# Altium project ENCE461SAM4s.PrjPcb
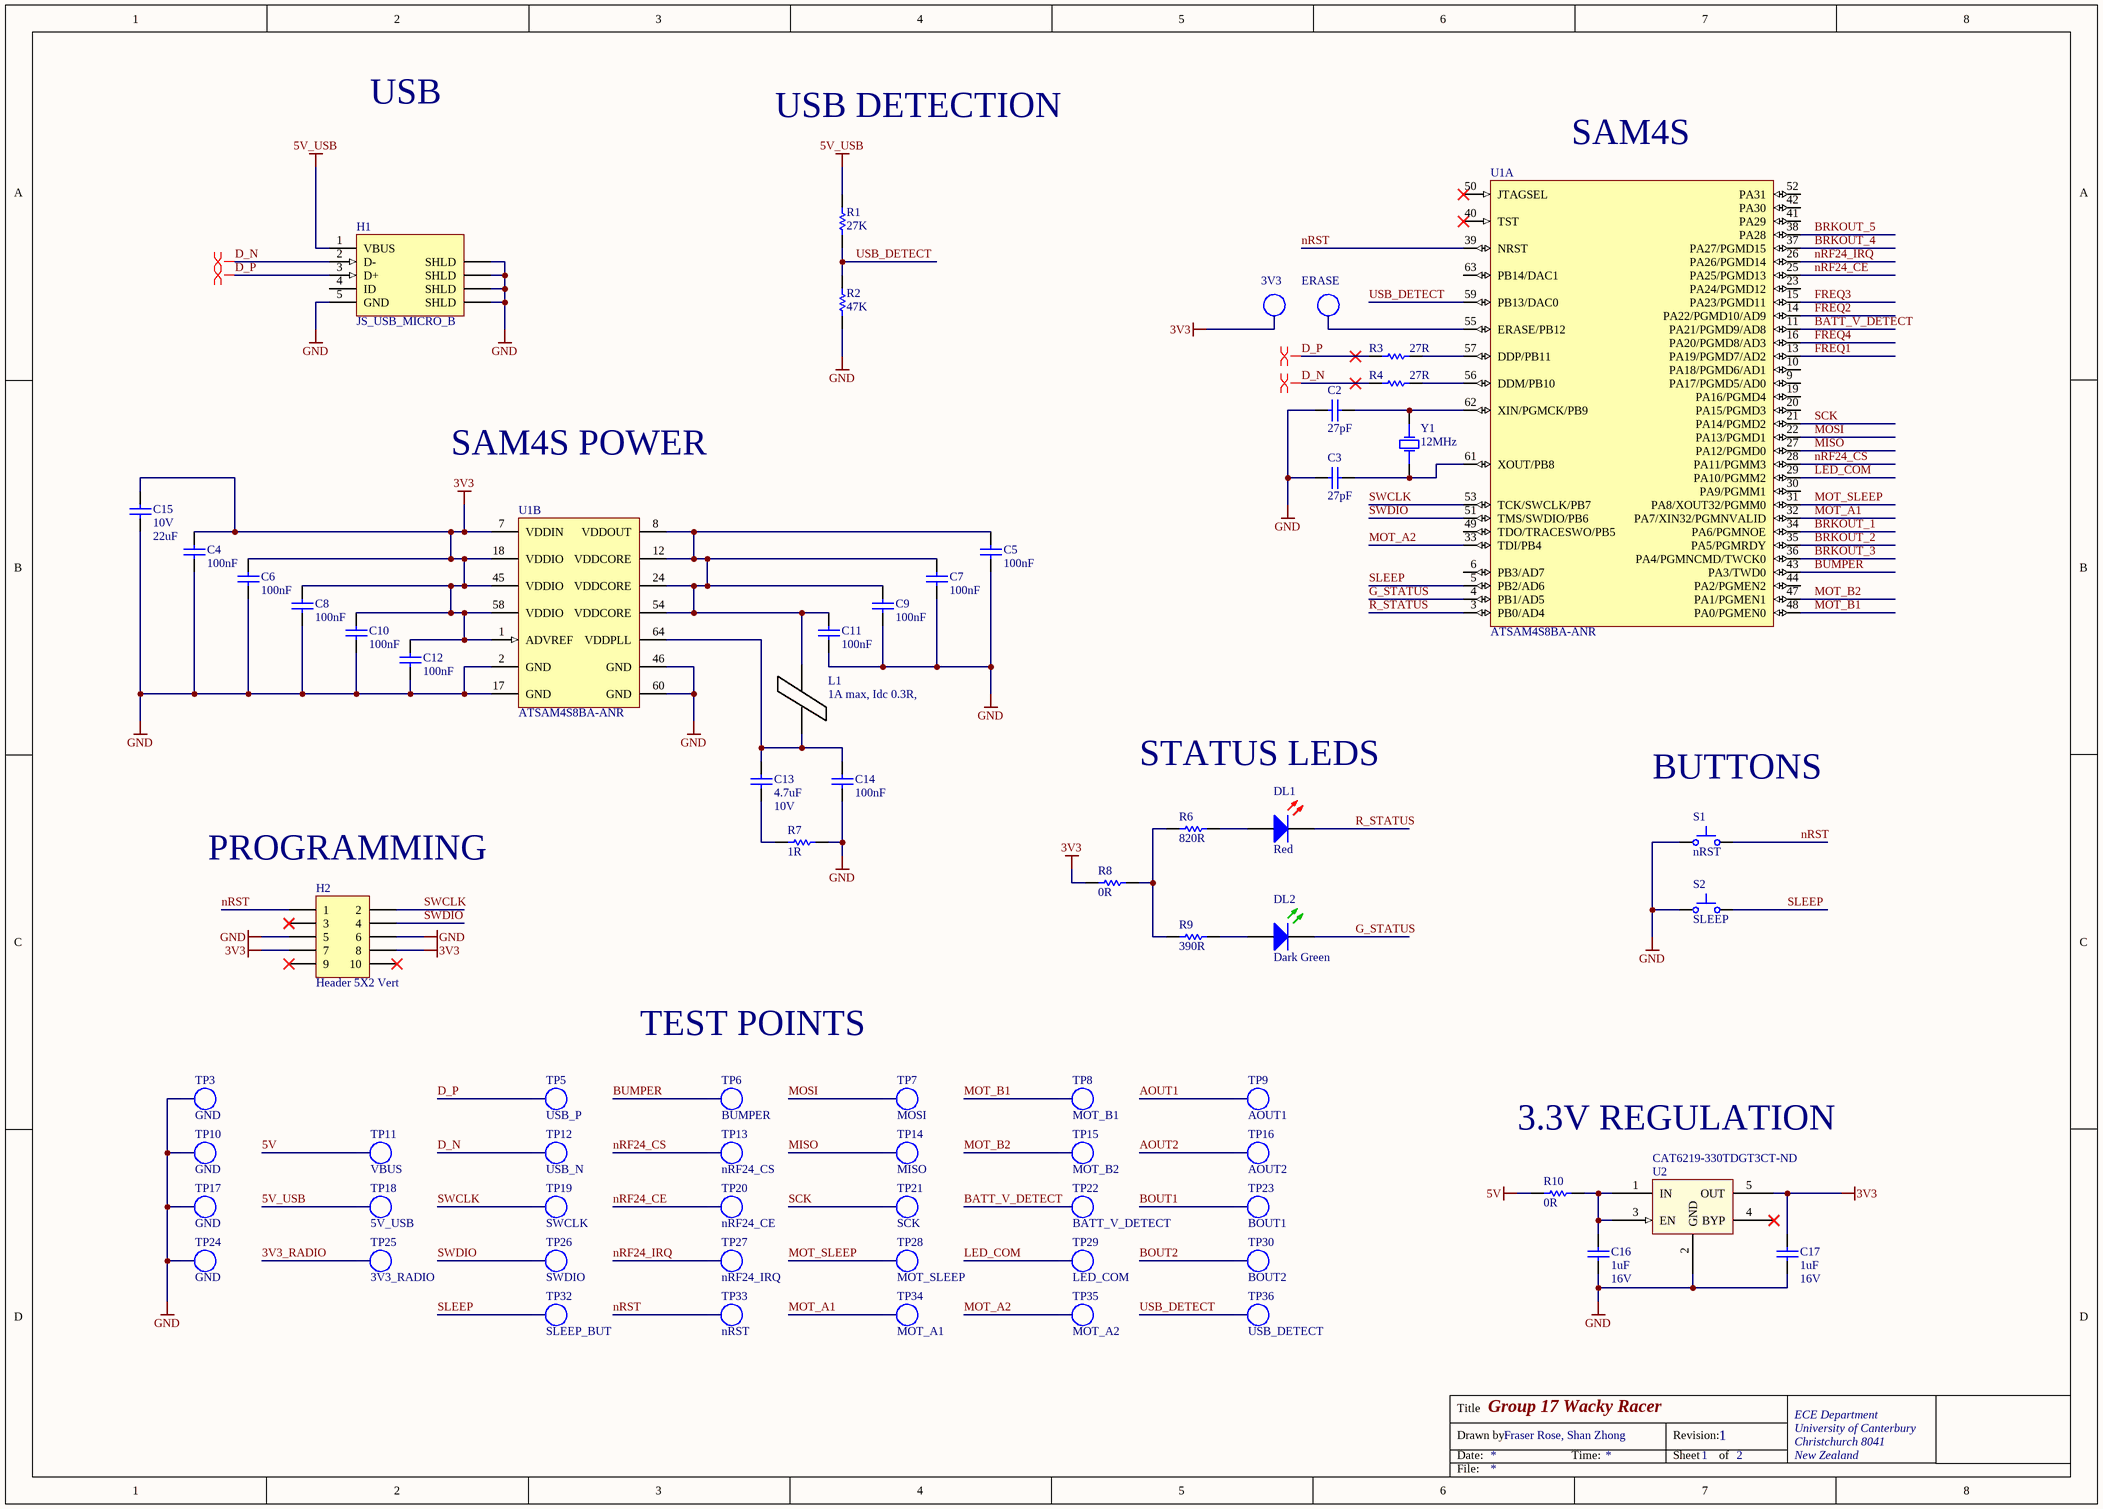
[diagram p0: SAM4s_Schematic.SchDoc]
2 sheets, 111 parts. Net scope: global (net labels, ports and power ports of the same name join across sheets).
Board file: RacerPCB.PcbDoc
Sheets:
  SAM4s_Schematic.SchDoc
  Ancillaries.SchDoc

## Sheet SAM4s_Schematic.SchDoc: Group 17 Wacky Racer
size A3; DrawnBy: Fraser Rose, Shan Zhong; Address1: ECE Department; Address2: University of Canterbury; Address3: Christchurch 8041; Address4: New Zealand; Revision: 1; SheetNumber: 1; SheetTotal: 2

### Parts
C2  27pF  [CAPC1608N]
C3  27pF  [CAPC1608N]
C4  100nF  [CAPC1608N]
C5  100nF  [CAPC1608N]
C6  100nF  [CAPC1608N]
C7  100nF  [CAPC1608N]
C8  100nF  [CAPC1608N]
C9  100nF  [CAPC1608N]
C10  100nF  [CAPC1608N]
C11  100nF  [CAPC1608N]
C12  100nF  [CAPC1608N]
C13  Max Voltage: 10V  [CAPC1608N]  (hidden comment: 4.7uF)
C14  100nF  [CAPC1608N]
C15  Max Voltage: 10V  [CAPC3216N]  (hidden comment: 22uF)
C16  Max Voltage: 16V  [CAPC1608N]  (hidden comment: 1uF)
C17  Max Voltage: 16V  [CAPC1608N]  (hidden comment: 1uF)
DL1  Red  [WL-SMCW0603]
DL2  Dark Green  [WL-SMCW0603]
H1  JS_USB_MICRO_B  [FCI_USB_10118194-0001LF]
H2  Header 5X2 Vert  [IDC2.54-V10D]
L1  1A max, Idc 0.3R,  [INDC3216N]
R1  27K  [RESC1608N]
R2  47K  [RESC1608N]
R3  27R  [RESC1608N]
R4  27R  [RESC1608N]
R6  820R  [RESC1608N]
R7  1R  [RESC3216N]
R8  0R  [RESC1608N]
R9  390R  [RESC1608N]
R10  0R  [RESC1608N]
S1  nRST  [EVQPNF05M]
S2  SLEEP  [EVQPNF05M]
TP1  3V3  [TP_0603]
TP2  ERASE  [TP_0603]
TP3  GND  [TP_0603]
TP5  USB_P  [TP_0603]
TP6  BUMPER  [TP_0603]
TP7  MOSI  [TP_0603]
TP8  MOT_B1  [TP_0603]
TP9  AOUT1  [TP_0603]
TP10  GND  [TP_0603]
TP11  VBUS  [TP_0603]
TP12  USB_N  [TP_0603]
TP13  nRF24_CS  [TP_0603]
TP14  MISO  [TP_0603]
TP15  MOT_B2  [TP_0603]
TP16  AOUT2  [TP_0603]
TP17  GND  [TP_0603]
TP18  5V_USB  [TP_0603]
TP19  SWCLK  [TP_0603]
TP20  nRF24_CE  [TP_0603]
TP21  SCK  [TP_0603]
TP22  BATT_V_DETECT  [TP_0603]
TP23  BOUT1  [TP_0603]
TP24  GND  [TP_0603]
TP25  3V3_RADIO  [TP_0603]
TP26  SWDIO  [TP_0603]
TP27  nRF24_IRQ  [TP_0603]
TP28  MOT_SLEEP  [TP_0603]
TP29  LED_COM  [TP_0603]
TP30  BOUT2  [TP_0603]
TP32  SLEEP_BUT  [TP_0603]
TP33  nRST  [TP_0603]
TP34  MOT_A1  [TP_0603]
TP35  MOT_A2  [TP_0603]
TP36  USB_DETECT  [TP_0603]
U1  ATSAM4S8BA-ANR  [LQFP64_L]  (parts A,B of 2)
U2  Supplier Part Number: CAT6219-330TDGT3CT-ND  [SOT95P280X145-5N]  (hidden comment: CAT6219-330TDGT3)
Y1  12MHz  [6.0X3.5-4]

### Nets
3V3: C4.2 C6.2 C8.2 C10.2 C12.2 C15.2 C17.2 H2.7 H2.8 R8.2 TP1.1(TP) U1.1(ADVREF) U1.7(VDDIN) U1.18(VDDIO) U1.45(VDDIO) U1.58(VDDIO) U2.5(OUT)
3V3_RADIO: TP25.1(TP)
5V: R10.2 TP11.1(TP)
5V_USB: H1.1(VBUS) R1.2 TP18.1(TP)
GND: C2.1 C3.1 C4.1 C5.1 C6.1 C7.1 C8.1 C9.1 C10.1 C11.1 C12.1 C14.1 C15.1 C16.1 C17.1 H1.5(GND) H1.6(SHLD) H2.5 H2.6 R2.1 R7.1 S1.1 S2.1 TP3.1(TP) TP10.1(TP) TP17.1(TP) TP24.1(TP) U1.2(GND) U1.17(GND) U1.46(GND) U1.60(GND) U2.2(GND)
AOUT1: TP9.1(TP)
AOUT2: TP16.1(TP)
BATT_V_DETECT: TP22.1(TP) U1.11(PA21/PGMD9/AD8)
BOUT1: TP23.1(TP)
BOUT2: TP30.1(TP)
BRKOUT_1: U1.34(PA6/PGMNOE)
BRKOUT_2: U1.35(PA5/PGMRDY)
BRKOUT_3: U1.36(PA4/PGMNCMD/TWCK0)
BRKOUT_4: U1.37(PA27/PGMD15)
BRKOUT_5: U1.38(PA28)
BUMPER: TP6.1(TP) U1.43(PA3/TWD0)
D_N: H1.2(D-) R4.1 TP12.1(TP)
D_P: H1.3(D+) R3.1 TP5.1(TP)
FREQ1: U1.13(PA19/PGMD7/AD2)
FREQ2: U1.14(PA22/PGMD10/AD9)
FREQ3: U1.15(PA23/PGMD11)
FREQ4: U1.16(PA20/PGMD8/AD3)
G_STATUS: DL2.1(K) U1.4(PB1/AD5)
LED_COM: TP29.1(TP) U1.29(PA10/PGMM2)
MISO: TP14.1(TP) U1.27(PA12/PGMD0)
MOSI: TP7.1(TP) U1.22(PA13/PGMD1)
MOT_A1: TP34.1(TP) U1.32(PA7/XIN32/PGMNVALID)
MOT_A2: TP35.1(TP) U1.33(TDI/PB4)
MOT_B1: TP8.1(TP) U1.48(PA0/PGMEN0)
MOT_B2: TP15.1(TP) U1.47(PA1/PGMEN1)
MOT_SLEEP: TP28.1(TP) U1.31(PA8/XOUT32/PGMM0)
nRF24_CE: TP20.1(TP) U1.25(PA25/PGMD13)
nRF24_CS: TP13.1(TP) U1.28(PA11/PGMM3)
nRF24_IRQ: TP27.1(TP) U1.26(PA26/PGMD14)
nRST: H2.1 S1.2 TP33.1(TP) U1.39(NRST)
R_STATUS: DL1.1(K) U1.3(PB0/AD4)
SCK: TP21.1(TP) U1.21(PA14/PGMD2)
SLEEP: S2.2 TP32.1(TP) U1.5(PB2/AD6)
SWCLK: H2.2 TP19.1(TP) U1.53(TCK/SWCLK/PB7)
SWDIO: H2.4 TP26.1(TP) U1.51(TMS/SWDIO/PB6)
USB_DETECT: R1.1 R2.2 TP36.1(TP) U1.59(PB13/DAC0)
NetC2_2: C2.2 U1.62(XIN/PGMCK/PB9) Y1.3(OSC2)
NetC3_2: C3.2 U1.61(XOUT/PB8) Y1.1(OSC1)
NetC5_2: C5.2 C7.2 C9.2 C11.2 L1.2 U1.8(VDDOUT) U1.12(VDDCORE) U1.24(VDDCORE) U1.54(VDDCORE)
NetC13_1: C13.1 R7.2
NetC13_2: C13.2 C14.2 L1.1 U1.64(VDDPLL)
NetC16_2: C16.2 R10.1 U2.1(IN) U2.3(EN)
NetDL1_2: DL1.2(A) R6.1
NetDL2_2: DL2.2(A) R9.2
NetR3_2: R3.2 U1.57(DDP/PB11)
NetR4_2: R4.2 U1.56(DDM/PB10)
NetR6_2: R6.2 R8.1 R9.1
NetTP2_1: TP2.1(TP) U1.55(ERASE/PB12)

Not connected (* = marked no-connect by the designer): H1 4(ID); H2 3* 9* 10*; U1 6(PB3/AD7) 9(PA17/PGMD5/AD0) 10(PA18/PGMD6/AD1) 19(PA16/PGMD4) 20(PA15/PGMD3) 23(PA24/PGMD12) 30(PA9/PGMM1) 40(TST)* 41(PA29) 42(PA30) 44(PA2/PGMEN2) 49(TDO/TRACESWO/PB5) 50(JTAGSEL)* 52(PA31) 63(PB14/DAC1); U2 4(BYP)*

### Layout directives
differential pair: D_N, D_P

### Notes on the sheet
- USB
- USB DETECTION
- (near U1) SAM4S
- SAM4S POWER
- STATUS LEDS
- BUTTONS
- (near H2) PROGRAMMING
- TEST POINTS
- 3.3V REGULATION
- Title
- Drawn by:
- Date:
- Time:
- Revision:
- Sheet
- of
- File:

### Library data of the parts
C2 C3 = CC_27pF_0603: CAP CER 27pF NPO/COG +-5% 50V 0603; PackageReference: 0603; Code_IPC: 1608 [0603]; Verify: *; Supplier: ECE Dept; Storage Location: PCB Assembly WS; Value: 27pF
C4-C12 C14 = CC_100nF_0603: CAP CER 100nF X7R +-10% 50V 0603; PackageReference: 0603; Code_IPC: 1608 [0603]; Verify: *; Supplier: ECE Dept; Storage Location: PCB Assembly WS; Value: 100nF
C13 = CC_4.7uF_0603: CAP CER 4.7uF X5R +-20%  10V 0603; Note: Footprint corresponds to dimensions for bulk cassette packaging. This case size has tightened tolerances.; PackageReference: 0805; Code_IPC: 2012[0805]; Verify: *; Supplier: ECE Dept; Storage Location: PCB Assembly WS; Value: 4.7uF
C15 = CC_22uF_1206: CAP CER 22uF Y5V -20% +80% 10V 1206; Verify: *; Supplier: ECE Dept; Storage Location: PCB Assembly WS; Dielectric: Y5V; Footprint: 1206 (3216 metric); Value: 22uF
C16 C17 = CC_1uF_0603: CAP CER 1uF Y5V -20% +80% 16V 0603; PackageReference: 0603; Code_IPC: 1608 [0603]; Verify: *; Supplier: ECE Dept; Storage Location: PCB Assembly WS; Value: 1uF
DL1 = DL_150060RS75000: LED Red 250mcd 0603 SMD; Manufacturer: WURTH ELEKTRONIK; Forward Current If: 30; Forward Voltage: 2; Lens Shape: Rectangular; Luminous Intensity: 250; Wavelength Typ: 625; Viewing Angle: 140°; LED Mounting: SMD; Supplier 1: Farnell; Supplier Part Number 1: 2322071; Manufacturer Part Number: 150060RS75000; Storage Location: PCB Assembly WS; Supplier: ECE Dept; LED Colour: Red
DL2 = DL_150060GS75000: LED Dk Green 430mcd 0603 SMD; Manufacturer: WURTH ELEKTRONIK; Forward Current If: 30; Wavelength Typ: 520; Forward Voltage: 3.2; Lens Shape: Rectangular; Luminous Intensity: 430; Viewing Angle: 140°; LED Mounting: SMD; Supplier 1: Farnell; Supplier Part Number 1: 2322070; Manufacturer Part Number: 150060GS75000; Storage Location: PCB Assembly WS; Supplier: ECE Dept; LED Colour: Dark Green
H1 = JS_USB_MICRO_B_SMT: CONN USB MICRO B RECPT SMT R/A; Manufacturer: FCI; Manufacturer Part Number: 10118194-0001LF; Gender: Receptacle; Number of Contacts: 5; Specifications: USB 2.0; Supplier 1: Digi-Key; Supplier Part Number 1: 609-4618-1-ND; Features: Shielded, Solder Retention; Mounting Type: Surface Mount, Right Angle, Horizontal
H2 = JA_HDR_IDC_5X2_VERT: IDC Header, 2,54mm, 10-Pin, Vert; Supplier: ECE Dept; Supplier 1: Farnell; Supplier Part Number 1: 1096985; Storage Location: ECE Dept Store
L1 = IN_Ferrite-Bead: Ferrite Bead, Rdc 0.3R, Z100MHZ 600R, Imax 1A, SMD 1206; Manufacturer: FAIR-RITE; Manufacturer PN: 2512066017Y1; DC Current Rating: 1; DC Resistance Max: 0.08; Ferrite Case Style: 1206 ^3216 Metric]; Frequency Range: 50MHz to 1; Impedance: 600; Impedance Tolerance: ± 25%; Supplier: ECE Dept; Storage Location: PCB Assembly WS; Ferrite Mounting: SMD; Supplier 1: Farnell; Supplier Part Number 1: 1612060; Manufacturer Part Number: 2512066017Y1; Value: 1A max, Idc 0.3R,
R1 = RS_27K: RES 27K OHM 1/10W 5% 0603 SMD; Storage Location: PCB Assembly WS; Supplier: ECE Dept; Value: 27K
R2 = RS_47K: RES 47.0K OHM 1/10W 5% 0603 SMD; Storage Location: PCB Assembly WS; Supplier: ECE Dept; Value: 47K
R3 R4 = RS_27R: RES 27 OHM 1/10W 5% 0603 SMD; Storage Location: PCB Assembly WS; Supplier: ECE Dept; Value: 27R
R6 = RS_820R: RES 820 OHM 1/10W 5% 0603 SMD; Storage Location: PCB Assembly WS; Supplier: ECE Dept; Value: 820R
R7 = RT_1R: RES 1R OHM 1/4W 5% 1206 SMD; Storage Location: PCB Assembly WS; Supplier: ECE Dept; Value: 1R
R8 R10 = RS_0R0: RES 0.0 OHM 1/10W 5% 0603 SMD; Storage Location: PCB Assembly WS; Supplier: ECE Dept; Value: 0R
R9 = RS_390R: RES 390 OHM 1/10W 5% 0603 SMD; Storage Location: PCB Assembly WS; Supplier: ECE Dept; Value: 390R
S1 S2 = WS_EVQPNF05M: Panasonic 6 x 3.5mm SMD Light Touch Switch Type SMD; PackageDescription: 6.0 x 3.5 mm; Supplier 1: Farnell; Supplier Part Number 1: 2079481; Manufacturer: Panasonic; Manufacturer PN: EVQPNF05M; Supplier 2: Digi-Key; Supplier Part Number 2: P13598SCT-ND; Storage Location: PCB Assembly WS; Supplier: ECE Dept
TP1-TP3 TP5-TP30 TP32-TP36 = TP_0603: Test Point 1.65X0.9X1.2mm SMD; Manufacturer: TE Connectivity AMP Connectors; Manufacturer Part Number: 1625854-3; Supplier 1: Digi-Key; Mounting Type: Surface Mount; Terminal: 0.063" x 0.031" x 0.045" (1.60mm x 0.80mm x 1.15mm); Type: PC Test Point; Supplier Part Number 1: A106145CT-ND
U1 = SE_ATSAM4S16BA-MU: IC MCU 32BIT 512KB FLASH 64LQFP; Manufacturer: Atmel; Connectivity: I²C, IrDA, Memory Card, SPI, SSC, UART/USART, USB; Core Processor: ARM® Cortex®-M4; Core Size: 32-Bit; Data Converters: A/D 11x12b, D/A 2x12b; Number of I/O: 47; Peripherals: Brown-out Detect/Reset, DMA, POR, PWM, WDT; Program Memory Size: 512KB (512K x 8); RAM Size: 128K x 8; Speed: 120MHz; Voltage - Supply (Vcc/Vdd): 1.62 V ~ 3.6 V; PackageVersion: revJ, Jul-2007; PackageReference: 64PS; PackageDescription: 64-Pin Quad Flat No-Lead (QFN) Sawn, 9 x 9 x 1.0 mm Body, 0.5 mm Pitch, Exposed Pad; Code_JEDEC: MO-220VMMD-3; ComponentLink1Description: Manufacturer URL; ComponentLink1URL: http://www.atmel.com/; ComponentLink2Description: SAM4S Series Datasheet; ComponentLink2URL: http://www.atmel.com/dyn/resources/prod_documents/11100.pdf; ComponentLink3Description: SAM4S Series Summary; ComponentLink3URL: http://www.atmel.com/dyn/resources/prod_documents/11100S.pdf; Supplier 1: Digi-Key; Package / Case: 64-LQFP; Packaging: Cut Tape (CT); Program Memory Type: FLASH; Supplier Part Number 1: ATSAM4S8BA-ANRCT-ND; Manufacturer Part Number: ATSAM4S8BA-ANR
U2 = SV_CAT6219-330TDGT3: IC REG LIN 3.3V 500MA TSOT23-5; Voltage - Input (Max): 5.5V; Voltage Dropout (Max): 0.5V @ 500mA; Manufacturer Part Number: CAT6219-330TDGT3; Base Part Number: CAT6219; Current - Output: 500mA; Package / Case: SOT-23-5 Thin, TSOT-23-5; Supplier: Digi-Key; Supplier Device Package: TSOT-23-5; Voltage - Output (Min/Fixed): 3.3V; ComponentLink1URL: http://www.onsemi.com/pub/Collateral/CAT6219-D.PDF; ComponentLink1Description: http://www.onsemi.com/pub/Collateral/CAT6219-D.PDF; Supplier 1: Digi-Key
Y1 = XT_CRYSTAL_12MHz_18pF: CRYSTAL 12MHZ 18PF 6X3.5mm SMD; Manufacturer: CTS-Frequency Controls; Manufacturer Part Number: 406C35D12M00000; ESR (Equivalent Series Resistance): 60 Ohm; Frequency Stability: ±50ppm; Frequency Tolerance: ±30ppm; Operating Mode: Fundamental; Supplier 1: Digi-Key; Height: 0.047" (1.20mm); Load Capacitance: 18pF; Mounting Type: Surface Mount; Operating Temperature: -20°C ~ 70°C; Package / Case: 4-SMD, No Lead (DFN, LCC); Size / Dimension: 0.236" L x 0.138" W (6.00mm x 3.50mm); Supplier Part Number 1: CTX855CT-ND; Frequency: 12MHz

## Sheet Ancillaries.SchDoc: Group 17 Wacky Racer
size A3; DrawnBy: Fraser Rose, Shan Zhong; Address1: ECE Department; Address2: University of Canterbury; Address3: Christchurch 8041; Address4: New Zealand; Revision: 1; SheetNumber: 2; SheetTotal: 2
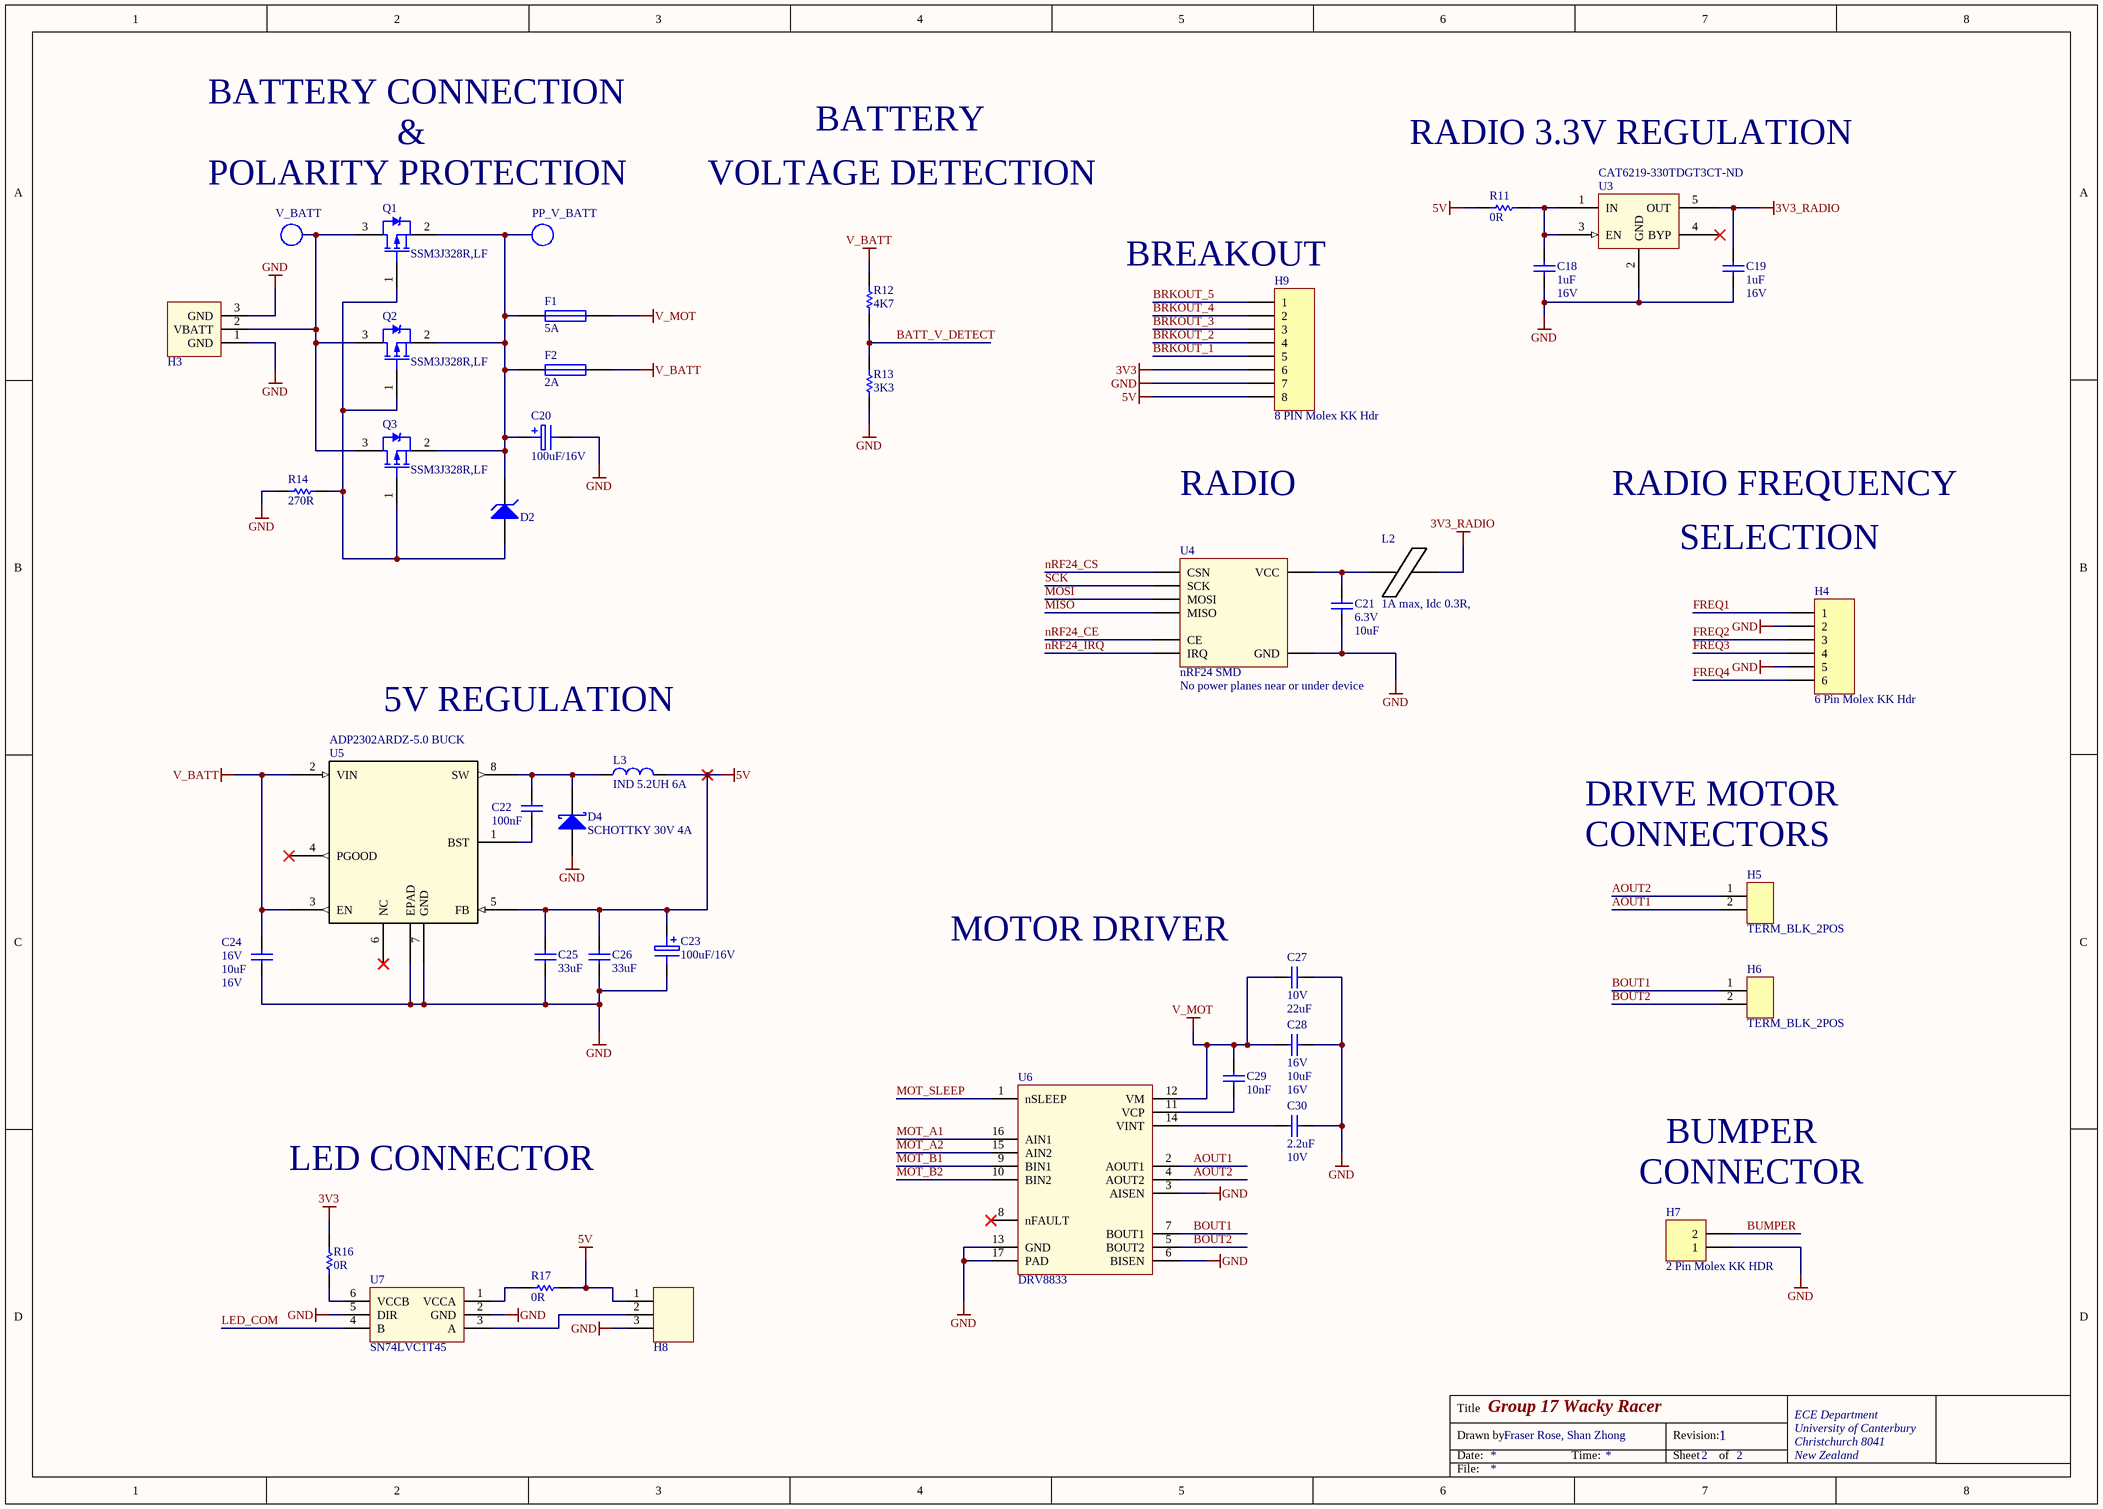
[diagram p1: Ancillaries.SchDoc]

### Parts
1  V_BATT  [TP_0603]
2  PP_V_BATT  [TP_0603]
C18  Max Voltage: 16V  [CAPC1608N]  (hidden comment: 1uF)
C19  Max Voltage: 16V  [CAPC1608N]  (hidden comment: 1uF)
C20  100uF/16V  [NICH-1]
C21  Voltage - Rated: 6.3V  [CAPC1608N]  (hidden comment: 10uF)
C22  100nF  [CAPC1608N]
C23  100uF/16V  [NICH-1]
C24  Voltage - Rated: 16V  [CAPC2012N]  (hidden comment: 10uF)
C25  33uF  [CAPC2012N]
C26  33uF  [CAPC2012N]
C27  Max Voltage: 10V  [CAPC3216N]  (hidden comment: 22uF)
C28  Voltage - Rated: 16V  [CAPC2012N]  (hidden comment: 10uF)
C29  10nF  [CAPC1608N]
C30  Max Voltage: 10V  [CAPC1608N]  (hidden comment: 2.2uF)
D2  DIODE ZENER 5.6V  [DO-214AA_SCL]  (value not drawn)
D4  SCHOTTKY 30V 4A  [SMC]
F1  5A  [RESC3216N]
F2  2A  [RESC3216N]
H3  Battery_HEADER_3pin  [BATT_HEADER_3POS]  (value not drawn)
H4  6 Pin Molex KK Hdr  [MOLEX_KK_6_HDR]
H5  TERM_BLK_2POS  [TERM_BLK_2POS]
H6  TERM_BLK_2POS  [TERM_BLK_2POS]
H7  2 Pin Molex KK HDR  [MOLEX_KK_2_HDR]
H8  HEADER_3  [HEADER_3POS]  (value not drawn)
H9  8 PIN Molex KK Hdr  [MOLEX_KK_8_HDR]
L2  1A max, Idc 0.3R,  [INDC3216L]
L3  IND 5.2UH 6A  [INDUCTOR5u2]
Q1  SSM3J328R,LF  [SOT23_N]
Q2  SSM3J328R,LF  [SOT23_N]
Q3  SSM3J328R,LF  [SOT23_N]
R11  0R  [RESC1608N]
R12  4K7  [RESC1608N]
R13  3K3  [RESC1608N]
R14  270R  [RESC1608N]
R16  0R  [RESC1608N]
R17  0R  [RESC1608N]
U3  Supplier Part Number: CAT6219-330TDGT3CT-ND  [SOT95P280X145-5N]  (hidden comment: CAT6219-330TDGT3)
U4  nRF24 SMD  Warning: No power planes near or under device  [NRF24]
U5  ADP2302ARDZ-5.0 BUCK  [RD_8_1]
U6  DRV8833  [HTSOP16]
U7  SN74LVC1T45  [SOT23-6_N]

### Nets
3V3: H9.6 R16.2
3V3_RADIO: C19.2 L2.2 U3.5(OUT)
5V: C23.2 C25.2 C26.2 H8.1 H9.8 L3.2 R11.2 R17.2 U5.5(FB)
GND: C18.1 C19.1 C20.1 C21.1 C23.1 C24.1 C25.1 C26.1 C27.2 C28.1 C30.1 D4.1(A) H3.1(GND) H3.3(GND) H4.2 H4.5 H7.1 H8.3 H9.7 R13.1 R14.2 U3.2(GND) U4.2(GND) U5.7(GND) U5.EPAD U6.3(AISEN) U6.6(BISEN) U6.13(GND) U6.17(PAD) U7.2(GND) U7.5(DIR)
V_BATT: C24.2 F2.2 R12.2 U5.2(VIN) U5.3(EN)
V_MOT: C27.1 C28.2 C29.2 F1.2 U6.12(VM)
AOUT1: H5.2 U6.2(AOUT1)
AOUT2: H5.1 U6.4(AOUT2)
BATT_V_DETECT: R12.1 R13.2
BOUT1: H6.1 U6.7(BOUT1)
BOUT2: H6.2 U6.5(BOUT2)
BRKOUT_1: H9.5
BRKOUT_2: H9.4
BRKOUT_3: H9.3
BRKOUT_4: H9.2
BRKOUT_5: H9.1
BUMPER: H7.2
FREQ1: H4.1
FREQ2: H4.3
FREQ3: H4.4
FREQ4: H4.6
LED_COM: U7.4(B)
MISO: U4.7(MISO)
MOSI: U4.6(MOSI)
MOT_A1: U6.16(AIN1)
MOT_A2: U6.15(AIN2)
MOT_B1: U6.9(BIN1)
MOT_B2: U6.10(BIN2)
MOT_SLEEP: U6.1(nSLEEP)
nRF24_CE: U4.3(CE)
nRF24_CS: U4.4(CSN)
nRF24_IRQ: U4.8(IRQ)
SCK: U4.5(SCK)
Net1_1: 1.1(TP) H3.2(VBATT) Q1.3 Q2.3 Q3.3
Net2_1: 2.1(TP) C20.2 D2.1(K) F1.1 F2.1 Q1.2 Q2.2 Q3.2
NetC18_2: C18.2 R11.1 U3.1(IN) U3.3(EN)
NetC21_2: C21.2 L2.1 U4.1(VCC)
NetC22_1: C22.1 U5.1(BST)
NetC22_2: C22.2 D4.2(K) L3.1 U5.8(SW)
NetC29_1: C29.1 U6.11(VCP)
NetC30_2: C30.2 U6.14(VINT)
NetD2_2: D2.2(A) Q1.1 Q2.1 Q3.1 R14.1
NetH8_2: H8.2 U7.3(A)
NetR16_1: R16.1 U7.6(VCCB)
NetR17_1: R17.1 U7.1(VCCA)

Not connected (* = marked no-connect by the designer): U3 4(BYP)*; U5 4(PGOOD)* 6(NC)*; U6 8(nFAULT)*

### Notes on the sheet
- BATTERY CONNECTION
- &
- BATTERY
- RADIO 3.3V REGULATION
- POLARITY PROTECTION
- VOLTAGE DETECTION
- (near H9) BREAKOUT
- RADIO
- RADIO FREQUENCY
- SELECTION
- 5V REGULATION
- DRIVE MOTOR
- (near H5) CONNECTORS
- MOTOR DRIVER
- LED CONNECTOR
- (near H7) CONNECTOR
- BUMPER
- Title
- Drawn by:
- Date:
- Time:
- Revision:
- Sheet
- of
- File:

### Library data of the parts
1 2 = TP_0603: as TP1 on sheet SAM4s_Schematic; Supplier 1: Digi-Key; Mounting Type: Surface Mount; Terminal: 0.063" x 0.031" x 0.045" (1.60mm x 0.80mm x 1.15mm); Type: PC Test Point; Supplier Part Number 1: A106145CT-ND
C18 C19 = CC_1uF_0603: CAP CER 1uF Y5V -20% +80% 16V 0603; PackageReference: 0603; Code_IPC: 1608 [0603]; Verify: *; Supplier: ECE Dept; Storage Location: PCB Assembly WS; Value: 1uF
C20 C23 = CA_100uF_16V: CAP ALUM 100uF 16V SMD; Manufacturer PN: UWX1C101MCL1GB; Manufacturer: Nichcon; Supplier 1: Farnell; Supplier Part Number 1: 1870677; Storage Location: PCB Assembly WS; Supplier: ECE Dept; Supplier 2: Digi-Key; Supplier Part Number 2: 493-2105-1-ND; Value: 100uF/16V
C21 = CC_10uF_0603: CAP CER 10UF X5R +-20% 6V3 0603; Supplier: ECE Dept; Storage Location: PCB Assembly WS; Value: 10uF
C22 = CC_100nF_0603: CAP CER 100nF X7R +-10% 50V 0603; PackageReference: 0603; Code_IPC: 1608 [0603]; Verify: *; Supplier: ECE Dept; Storage Location: PCB Assembly WS; Value: 100nF
C24 C28 = CC_10uF_16V_0805: CAP CER 10uF X5R 16V 0805; Manufacturer: Samsung Electro-Mechanics; Manufacturer Part Number: CL21A106KOQNNWE; Note: Footprint corresponds to dimensions for bulk cassette packaging. This case size has tightened tolerances.; Tolerance: ±10%; Notification: Current market demand for these product types have resulted in fluctuating and extending lead times. Lead times may differ.; PackageReference: 0805; Code_IPC: 2012[0805]; Supplier 1: Digi-Key; RoHS: RoHS Compliant; Category: Capacitors; Stock 1: 20000; Pricing 1: 1=0.35, 10=0.25, 100=0.1178, 500=0.08254, 1000=0.06831 (NZD); Packaging: Cut Tape (CT); Part Status: Active; Temperature Coefficient: X5R; Operating Temperature: -55°C ~ 85°C; Features: -; Ratings: -; Applications: General Purpose; Mounting Type: Surface Mount, MLCC; Package / Case: 0805 (2012 Metric); Size / Dimension: 0.079" L x 0.049" W (2.00mm x 1.25mm); Height - Seated (Max): -; Thickness (Max): 0.055" (1.40mm); Lead Spacing: -; Lead Style: -; ComponentLink1URL: http://www.samsungsem.com/kr/support/product-search/mlcc/CL21A106KOQNNWE.jsp; ComponentLink1Description: http://www.samsungsem.com/kr/support/product-search/mlcc/CL21A106KOQNNWE.jsp; Supplier Part Number 1: 1276-2894-1-ND; Value: 10uF; Max Voltage: 16V
C25 C26 = CC_33uF_6V3_0805: CAP CER 33uF X5R 6V3 0805; Manufacturer: TDK Corporation; Manufacturer Part Number: C2012X5R0J336M125AC; Tolerance: ±20%; Voltage - Rated: 6.3V; Notification: Current market demand for these product types have resulted in fluctuating and extending lead times. Lead times may differ.; Supplier 1: Digi-Key; RoHS: RoHS Compliant; Category: Capacitors; Stock 1: 20000; Pricing 1: 1=1.65, 10=1.262, 100=0.9023, 500=0.6985, 1000=0.60149 (NZD); Packaging: Cut Tape (CT); Part Status: Active; Temperature Coefficient: X5R; Operating Temperature: -55°C ~ 85°C; Features: Low ESL; Ratings: -; Applications: General Purpose; Failure Rate: -; Mounting Type: Surface Mount, MLCC; Package / Case: 0805 (2012 Metric); Size / Dimension: 0.079" L x 0.049" W (2.00mm x 1.25mm); Height - Seated (Max): -; Thickness (Max): 0.057" (1.45mm); Lead Spacing: -; Lead Style: -; ComponentLink1URL: https://product.tdk.com/info/en/catalog/datasheets/mlcc_commercial_general_en.pdf; ComponentLink1Description: https://product.tdk.com/info/en/catalog/datasheets/mlcc_commercial_general_en.pdf; Supplier Part Number 1: 445-5986-1-ND; Value: 33uF
C27 = CC_22uF_1206: CAP CER 22uF Y5V -20% +80% 10V 1206; Verify: *; Supplier: ECE Dept; Storage Location: PCB Assembly WS; Dielectric: Y5V; Footprint: 1206 (3216 metric); Value: 22uF
C29 = CC_10nF_0603: CAP CER 10nF X7R +-10% 50V 0603; PackageReference: 0603; Code_IPC: 1608 [0603]; Verify: *; Supplier: ECE Dept; Storage Location: PCB Assembly WS; Value: 10nF
C30 = CC_2.2uF_0603: CAP CER 2.2uF X5R +-20% 10V 0603; PackageReference: 0603; Code_IPC: 1608 [0603]; Verify: *; Supplier: ECE Dept; Storage Location: PCB Assembly WS; Value: 2.2uF
D2 = SMBJ5339B-TP: DIODE ZENER 5.6V 5W DO214AA; Manufacturer: Micro Commercial Co; Tolerance: ±5%; Supplier 1: Digi-Key; Manufacturer Part Number: SMBJ5339B-TP; RoHS: RoHS Compliant; Category: Discrete Semiconductor Products; Stock 1: 85990; Pricing 1: 1=1.47, 10=1.277, 25=1.1312, 100=0.9853, 250=0.85764, 500=0.72988, 1000=0.58391 (NZD); Packaging: Cut Tape (CT); Part Status: Active; Operating Temperature: -55°C ~ 150°C; Mounting Type: Surface Mount; Package / Case: DO-214AA, SMB; Supplier Device Package: DO-214AA (SMB); Base Part Number: SMBJ5339; ComponentLink1URL: http://www.mccsemi.com/up_pdf/SMBJ5338B-SMBJ5388B(SMB).pdf; ComponentLink1Description: http://www.mccsemi.com/up_pdf/SMBJ5338B-SMBJ5388B(SMB).pdf; Supplier Part Number 1: SMBJ5339B-TPMSCT-ND
D4 = MBRS330T3G: DIODE SCHOTTKY 30V 4A SMC; Manufacturer: ON Semiconductor; Speed: Fast Recovery =< 500ns, > 200mA (Io); Supplier 1: Digi-Key; Manufacturer Part Number: MBRS330T3G; RoHS: RoHS Compliant; Category: Discrete Semiconductor Products; Stock 1: 8919; Pricing 1: 1=0.93, 10=0.79, 100=0.5902, 500=0.46368, 1000=0.35829 (NZD); Packaging: Cut Tape (CT); Part Status: Active; Diode Type: Schottky; Current - Average Rectified (Io): 4A; Capacitance @ Vr, F: -; Mounting Type: Surface Mount; Package / Case: DO-214AB, SMC; Supplier Device Package: SMC; Operating Temperature - Junction: -65°C ~ 150°C; Base Part Number: MBRS330; ComponentLink1URL: http://www.onsemi.com/pub/Collateral/MBRS340T3-D.PDF; ComponentLink1Description: http://www.onsemi.com/pub/Collateral/MBRS340T3-D.PDF; Supplier Part Number 1: MBRS330T3GOSCT-ND
F1 = FS_Fuse_5.0A: Fuse 5.0A Fast Acting 1206 SMD; Manufacturer Part Number: C1F5; Manufacturer: Bel TRP; Voltage Rating (AC): 125V; Voltage Rating (DC): 63V; DC Cold Resistance: 19mR; Fuse Type: Board Mount (Cartridge Style Excluded); Approvals: CE,cURus; Mount: Surface Mount; Case/Package: 1206; Number of Pins: 2; Case Code (Metric): 3216; Case Code (Imperial): 1206; Contact Plating: Nickel,Tin; Min Operating Temperature: -55°C; Max Operating Temperature: 125°C; Packaging: Tape and Reel; Voltage Rating: 125V; Length: 0.126inch; Width: 0.062inch; Supplier 1: Digi-Key; Stock 1: 725; Pricing 1: 1=0.32, 5=0.312, 10=0.298, 50=0.2662, 100=0.2479, 250=0.22032, 500=0.1836, 1000=0.17442 (USD); ComponentLink1URL: http://www.farnell.com/datasheets/2571625.pdf; ComponentLink1Description: http://www.farnell.com/datasheets/2571625.pdf; ComponentLink2URL: http://belfuse.com/pdfs/C1F.pdf; ComponentLink2Description: http://belfuse.com/pdfs/C1F.pdf; ComponentLink3URL: http://www.mouser.com/ds/2/643/C1F-594910.pdf; ComponentLink3Description: http://www.mouser.com/ds/2/643/C1F-594910.pdf; ComponentLink4URL: https://belfuse.com/resources/StewartConnector/C1F.pdf; ComponentLink4Description: https://belfuse.com/resources/StewartConnector/C1F.pdf; Current Rating: 5A; Supplier Part Number 1: 507-1886-1-ND; Supplier 2: Element14; Supplier Part Number 2: 2848595; Value: 5A
F2 = FS_Fuse_2.0A: Fuse 2.0A Very Fast Acting 1206 SMD; Manufacturer: MULTICOMP; Manufacturer PN: MC12CF 002; Supplier: ECE Dept; Storage Location: PCB Assembly WS; Supplier 1: Farnell; Supplier Part Number 1: 1841029; Manufacturer Part Number: MC12CF 002; Value: 2A
H3 = Battery_HEADER_3pin: 3Pin Header 2.54mm spacing
H4 = JA_MOLEX_KK_6POS: CONN HEADER 6POS 2.54mm VERT_Thru Hole; Supplier Part Number 1: 1462922; Supplier: ECE Dept; Supplier 1: Farnell; Storage Location: ECE Dept Store; Value: 6 Pin Molex KK Hdr
H5 H6 = TERM_BLK_2POS: 2 Position Terminal Block 7.62mm spacing
H7 = JA_MOLEX_KK_2POS: CONN HEADER 2POS 2.54mm VERT_Thru Hole; Supplier 1: Farnell; Supplier Part Number 1: 1462926; Supplier: ECE Dept; Storage Location: ECE Dept Store; Value: 2 Pin Molex KK HDR
H8 = HEADER_3: 3Pin Header 2.54mm spacing
H9 = JA_MOLEX_KK_8POS: CONN HEADER 8POS 2.54mm VERT_Thru Hole; Supplier 1: Farnell; Supplier Part Number 1: 1756826; Supplier: ECE Dept; Storage Location: ECE Dept Store; Value: 8 PIN Molex KK Hdr
L2 = IN_Ferrite-Bead: as L1 on sheet SAM4s_Schematic; Supplier: ECE Dept; Storage Location: PCB Assembly WS; Ferrite Mounting: SMD; Supplier 1: Farnell; Supplier Part Number 1: 1612060; Manufacturer Part Number: 2512066017Y1; Value: 1A max, Idc 0.3R,
L3 = CDRH104RNP-5R2NC: FIXED IND 5.2UH 6A 22 MOHM SMD; Manufacturer: Sumida America Components Inc.; Material - Core: Ferrite; Tolerance: ±30%; Current - Saturation: 5.6A; Shielding: Shielded; DC Resistance (DCR): 22 mOhm Max; Supplier 1: Digi-Key; Manufacturer Part Number: CDRH104RNP-5R2NC; RoHS: RoHS Compliant; Category: Inductors, Coils, Chokes; Stock 1: 3849; Pricing 1: 1=2.9, 10=2.678, 100=1.8743, 500=1.5173 (NZD); Packaging: Cut Tape (CT); Part Status: Active; Type: -; Q @ Freq: -; Frequency - Self Resonant: -; Ratings: -; Operating Temperature: -40°C ~ 100°C; Mounting Type: Surface Mount; Package / Case: Nonstandard; Supplier Device Package: -; Size / Dimension: 0.402" L x 0.394" W (10.20mm x 10.00mm); Height - Seated (Max): 0.157" (4.00mm); ComponentLink1URL: http://products.sumida.com/products/pdf/CDRH104R.pdf; ComponentLink1Description: http://products.sumida.com/products/pdf/CDRH104R.pdf; Supplier Part Number 1: 308-2280-1-ND
Q1-Q3 = TM_SSM3J328R: MOSFET P-CH 20V 6A SOT23-3; Manufacturer: Toshiba; FET Feature: Logic Level Gate, 1.5V Drive; FET Type: MOSFET P-Channel, Metal Oxide; Gate Charge (Qg) @ Vgs: 12.8nC @ 4.5V; Input Capacitance (Ciss) @ Vds: 840pF @ 10V; Power - Max: 1W; Rds On Max: 29.8mR; Drain to Source Resistance: 47.4mR; Turn-On Delay Time: 32ns; Power Dissipation: 2W; Number of Channels: 1; Turn-Off Delay Time: 107ns; Gate to Source Voltage (Vgs): 8V; Input Capacitance: 840pF; Element Configuration: Single; Drain to Source Breakdown Voltage: -20V; Vgs(th) (Max) @ Id: 1V @ 1mA; Current - Continuous Drain (Id) @ 25° C: 6A; Drain to Source Voltage (Vdss): 20V; Package / Case: SOT-23-3 Flat Leads; Supplier Device Package: SOT-23F; Pricing: 1=0.79, 10=0.658, 25=0.5772, 100=0.4939, 250=0.42836, 500=0.36284, 1000=0.27972 (NZD); Storage Location: PCB Assembly WS; Supplier: Digi-Key; ComponentLink1URL: https://datasheet.ciiva.com/11158/ssm3j328r-datasheet-en-20140301-11158652.pdf; ComponentLink1Description: https://datasheet.ciiva.com/11158/ssm3j328r-datasheet-en-20140301-11158652.pdf; Supplier Part Number: SSM3J328RLFDKR-ND; Max Operating Temperature: 150°C; Mount: Surface Mount; Packaging: Tape and Reel; Min Operating Temperature: -55°C; Continuous Drain Current (ID): 6A; Radiation Hardening: No; Max Power Dissipation: 1W; Package Quantity: 3000; Case/Package: SOT-23-3; Number of Pins: 3; Number of Elements: 1; Supplier 1: Digi-Key; Supplier Part Number 1: SSM3J328RLFDKR-ND; Manufacturer Part Number: SSM3J328R,LF
R11 R16 R17 = RS_0R0: RES 0.0 OHM 1/10W 5% 0603 SMD; Storage Location: PCB Assembly WS; Supplier: ECE Dept; Value: 0R
R12 = RS_4K7: RES 4.7K OHM 1/10W 5% 0603 SMD; Storage Location: PCB Assembly WS; Supplier: ECE Dept; Value: 4K7
R13 = RS_3K3: RES 3.3K OHM 1/10W 5% 0603 SMD; Storage Location: PCB Assembly WS; Supplier: ECE Dept; Value: 3K3
R14 = RS_270R: RES 270 OHM 1/10W 5% 0603 SMD; Storage Location: PCB Assembly WS; Supplier: ECE Dept; Value: 270R
U3 = SV_CAT6219-330TDGT3: as U2 on sheet SAM4s_Schematic; Manufacturer Part Number: CAT6219-330TDGT3; Base Part Number: CAT6219; Current - Output: 500mA; Package / Case: SOT-23-5 Thin, TSOT-23-5; Supplier: Digi-Key; Supplier Device Package: TSOT-23-5; Voltage - Output (Min/Fixed): 3.3V; ComponentLink1URL: http://www.onsemi.com/pub/Collateral/CAT6219-D.PDF; ComponentLink1Description: http://www.onsemi.com/pub/Collateral/CAT6219-D.PDF; Supplier 1: Digi-Key
U4 = NRF24: nRF24 SMD Module
U5 = ADP2302ARDZ-5.0-R7: IC REG BUCK 5V 2A 8SOIC; Vendor: Analog Devices Inc; Frequency - Switching: 700kHz; Output Type: Fixed; Voltage - Input (Max): 20V; Manufacturer_Part_Number: ADP2302ARDZ-5.0-R7; Type: DEV; Value: Value; Supplier 1: Digi-Key; Current - Output: 2A; Voltage - Output (Min/Fixed): 5V; Supplier Part Number 1: ADP2302ARDZ-5.0-R7CT-ND
U6 = DRV8833: Dual H-Bridge Motor Driver 1.5A
U7 = SN74LVC1T45: 1.8V - 5V level converter

## Nets that join several sheets
3V3: SAM4s_Schematic (17 pins), Ancillaries (H9.6 R16.2)
3V3_RADIO: SAM4s_Schematic (TP25.1), Ancillaries (C19.2 L2.2 U3.5)
5V: SAM4s_Schematic (R10.2 TP11.1), Ancillaries (9 pins)
GND: SAM4s_Schematic (32 pins), Ancillaries (31 pins)
AOUT1: SAM4s_Schematic (TP9.1), Ancillaries (H5.2 U6.2)
AOUT2: SAM4s_Schematic (TP16.1), Ancillaries (H5.1 U6.4)
BATT_V_DETECT: SAM4s_Schematic (TP22.1 U1.11), Ancillaries (R12.1 R13.2)
BOUT1: SAM4s_Schematic (TP23.1), Ancillaries (H6.1 U6.7)
BOUT2: SAM4s_Schematic (TP30.1), Ancillaries (H6.2 U6.5)
BRKOUT_1: SAM4s_Schematic (U1.34), Ancillaries (H9.5)
BRKOUT_2: SAM4s_Schematic (U1.35), Ancillaries (H9.4)
BRKOUT_3: SAM4s_Schematic (U1.36), Ancillaries (H9.3)
BRKOUT_4: SAM4s_Schematic (U1.37), Ancillaries (H9.2)
BRKOUT_5: SAM4s_Schematic (U1.38), Ancillaries (H9.1)
BUMPER: SAM4s_Schematic (TP6.1 U1.43), Ancillaries (H7.2)
FREQ1: SAM4s_Schematic (U1.13), Ancillaries (H4.1)
FREQ2: SAM4s_Schematic (U1.14), Ancillaries (H4.3)
FREQ3: SAM4s_Schematic (U1.15), Ancillaries (H4.4)
FREQ4: SAM4s_Schematic (U1.16), Ancillaries (H4.6)
LED_COM: SAM4s_Schematic (TP29.1 U1.29), Ancillaries (U7.4)
MISO: SAM4s_Schematic (TP14.1 U1.27), Ancillaries (U4.7)
MOSI: SAM4s_Schematic (TP7.1 U1.22), Ancillaries (U4.6)
MOT_A1: SAM4s_Schematic (TP34.1 U1.32), Ancillaries (U6.16)
MOT_A2: SAM4s_Schematic (TP35.1 U1.33), Ancillaries (U6.15)
MOT_B1: SAM4s_Schematic (TP8.1 U1.48), Ancillaries (U6.9)
MOT_B2: SAM4s_Schematic (TP15.1 U1.47), Ancillaries (U6.10)
MOT_SLEEP: SAM4s_Schematic (TP28.1 U1.31), Ancillaries (U6.1)
nRF24_CE: SAM4s_Schematic (TP20.1 U1.25), Ancillaries (U4.3)
nRF24_CS: SAM4s_Schematic (TP13.1 U1.28), Ancillaries (U4.4)
nRF24_IRQ: SAM4s_Schematic (TP27.1 U1.26), Ancillaries (U4.8)
SCK: SAM4s_Schematic (TP21.1 U1.21), Ancillaries (U4.5)